# Altium project CAPTIVATE-PGMR.PrjPcb (part 2 of 3)

## Sheet ezfet.SchDoc
size 431 x 279 mm; Date: Not shown in title block; ApprovedBy: Not shown in title block; CheckedBy: Not shown in title block; Author: Not shown in title block; CompanyName: Not shown in title block; Engineer: Not shown in title block; Organization: Not shown in title block; Address1: Not shown in title block; Address2: Not shown in title block; Address3: Not shown in title block; Address4: Not shown in title block; DocumentNumber: 1; Revision: Use project parameter SCH_Rev; SheetNumber: 1; SheetTotal: 6; PageSetup: Record=PageOptions|CenterHorizontal=True|CenterVertical=True|PrintScale=1.00|XCorrection=1.00|YCorrection=1.00|PrintKind=0|BorderSize=5000000|LeftOffset=0|BottomOffset=0|Orientation=2|PaperLength=1000|PaperWidth=1000|Scale=100|PaperSource=15|PrintQuality=600|MediaType=1|DitherType=10|PaperKind=Letter|PrintScaleMode=1; CurrentTime: Not shown in title block; CurrentDate: Not shown in title block; Time: Not shown in title block; DocumentFullPathAndName: Not shown in title block; DocumentName: Not shown in title block; ModifiedDate: Not shown in title block; ImagePath: Not shown in title block
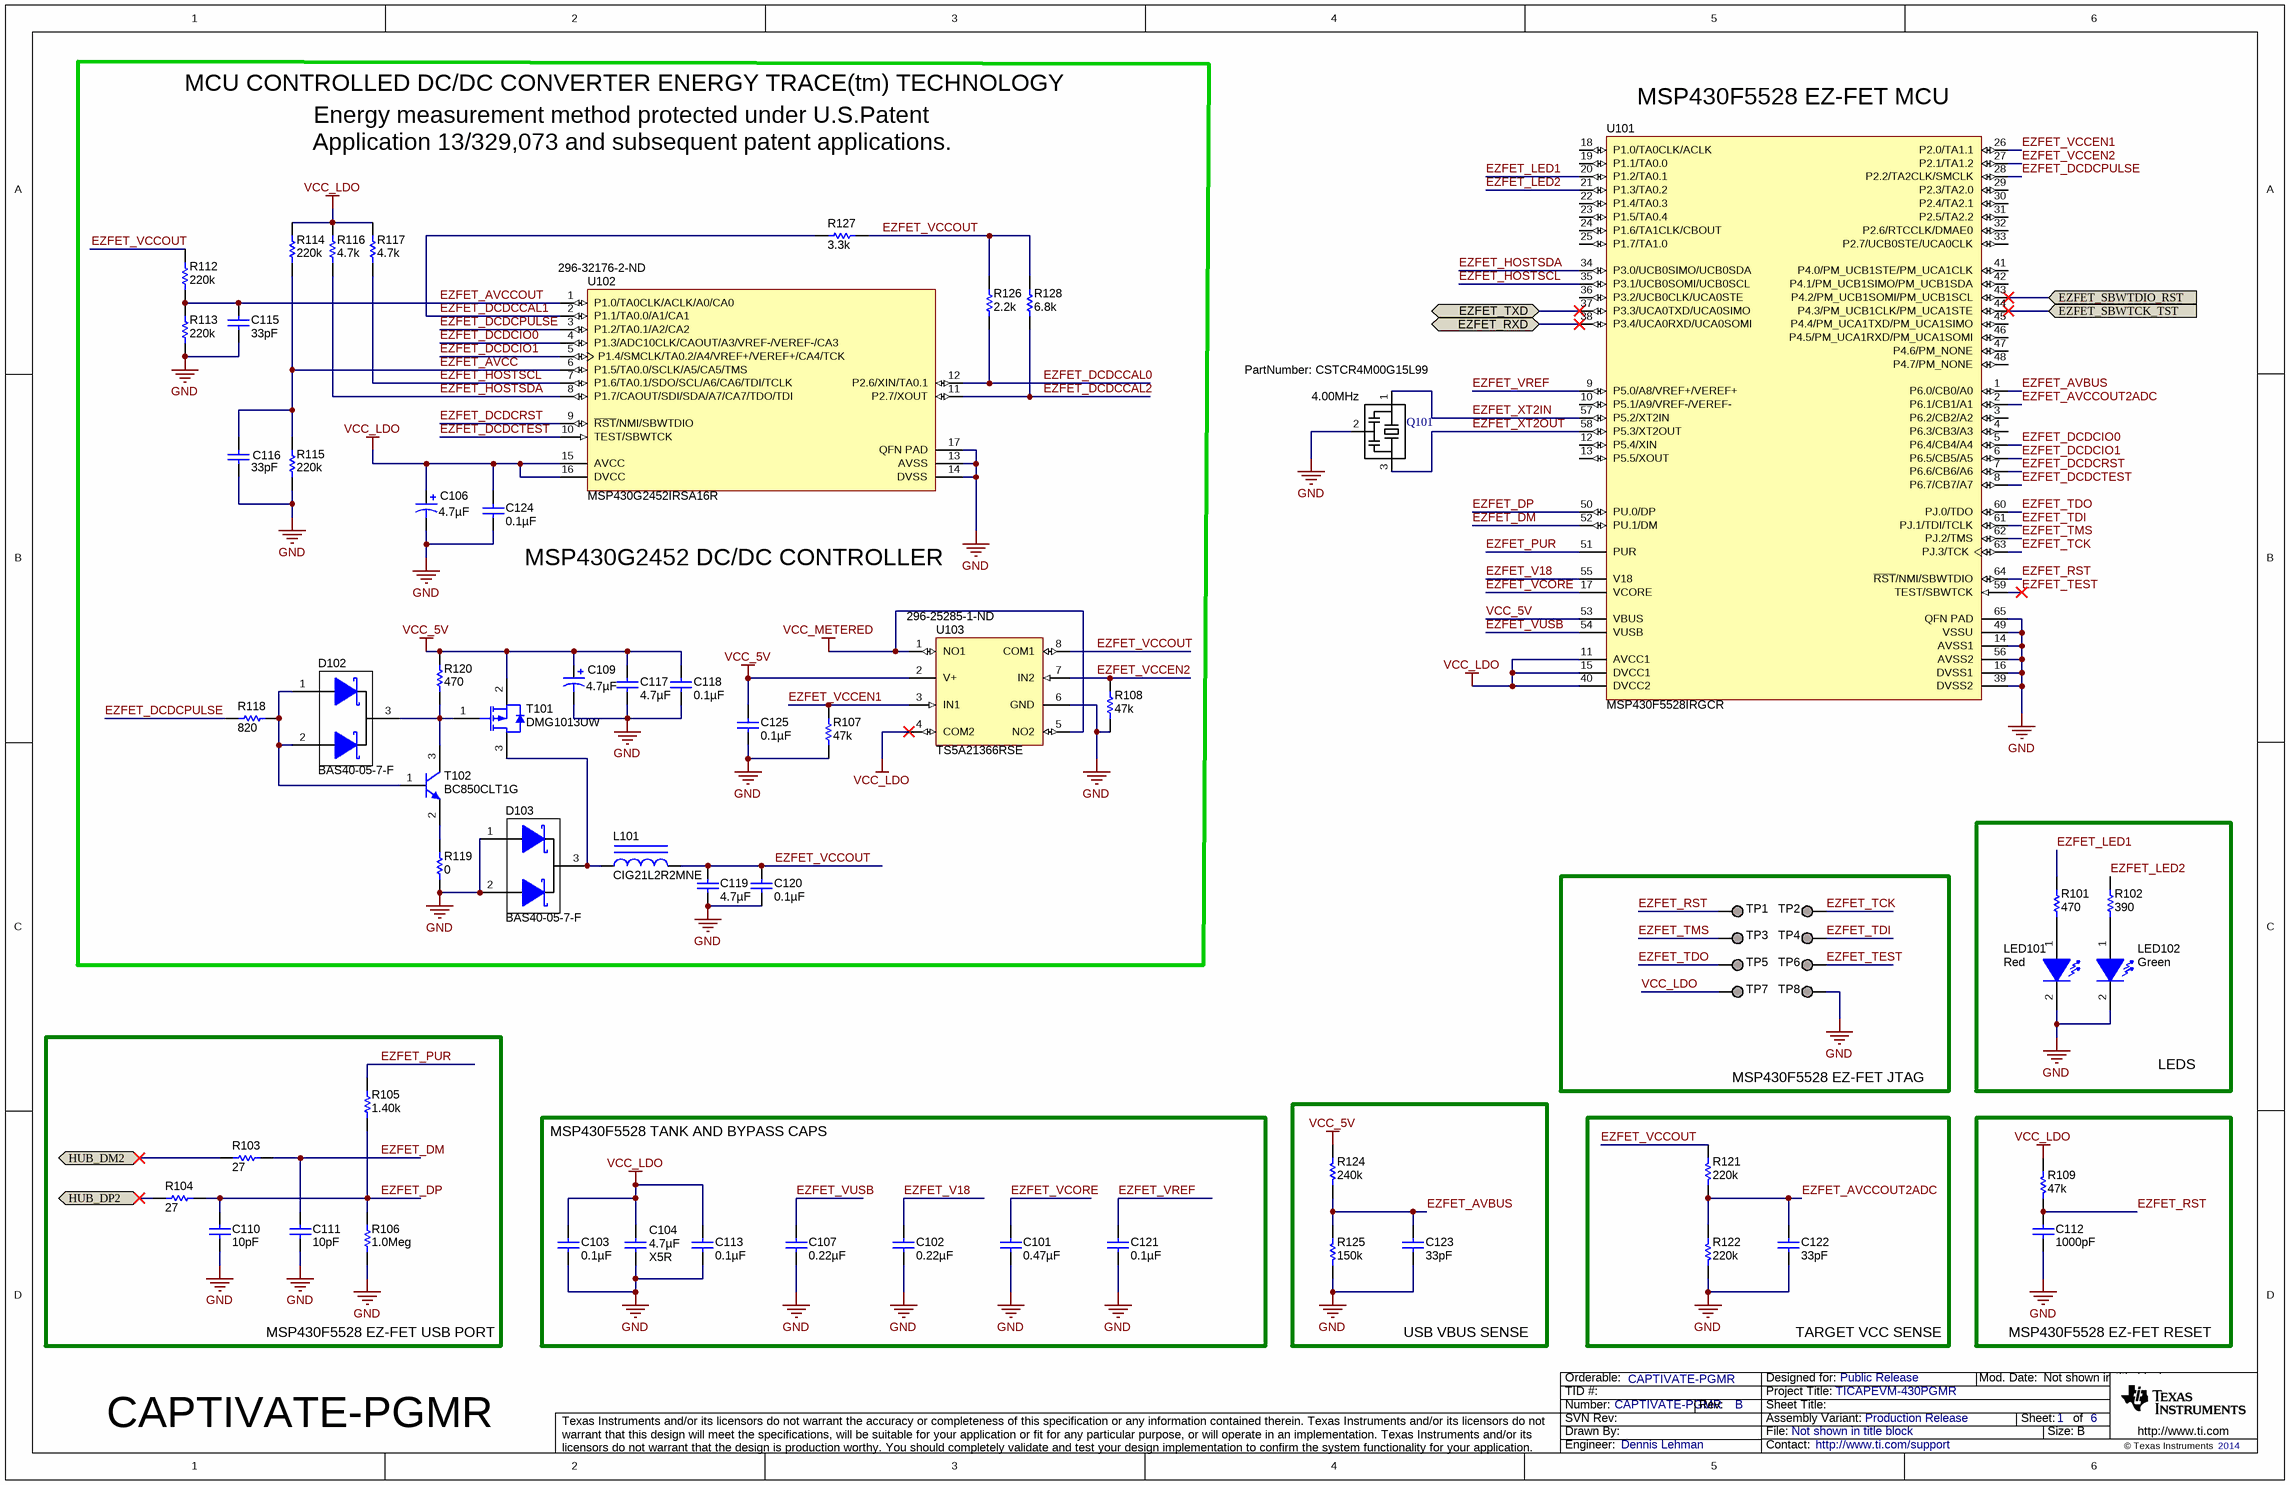
[diagram p2: ezfet.SchDoc]

### Parts
C101  ValueDisplayed: 0.47µF  [0402]  (hidden comment: GRM155R61A474KE15D)
C102  ValueDisplayed: 0.22µF  [0402]  (hidden comment: GRM155R61A224KE19D)
C103  ValueDisplayed: 0.1µF  [0402]  (hidden comment: C1005X5R1A104K)
C104  ValueDisplayed: 4.7µF  TempCo: X5R  [0603]  (hidden comment: CGB3B1X5R1A475K055AC)
C106  ValueDisplayed: 4.7µF  [3216-18]  (hidden comment: 293D475X9010A2TE3)
C107  ValueDisplayed: 0.22µF  [0402]  (hidden comment: GRM155R61A224KE19D)
C109  ValueDisplayed: 4.7µF  [3216-18]  (hidden comment: 293D475X9010A2TE3)
C110  ValueDisplayed: 10pF  [0402]  (hidden comment: 500R07S100JV4T)
C111  ValueDisplayed: 10pF  [0402]  (hidden comment: 500R07S100JV4T)
C112  ValueDisplayed: 1000pF  [0402]  (hidden comment: C1005X7R1H102K)
C113  ValueDisplayed: 0.1µF  [0402]  (hidden comment: C1005X5R1A104K)
C115  ValueDisplayed: 33pF  [0402]  (hidden comment: GRM1555C1H330JA01D)
C116  ValueDisplayed: 33pF  [0402]  (hidden comment: GRM1555C1H330JA01D)
C117  ValueDisplayed: 4.7µF  [0603]  (hidden comment: 0603ZD475KAT2A)
C118  ValueDisplayed: 0.1µF  [0402]  (hidden comment: C1005X5R1A104K)
C119  ValueDisplayed: 4.7µF  [0603]  (hidden comment: 0603ZD475KAT2A)
C120  ValueDisplayed: 0.1µF  [0402]  (hidden comment: C1005X5R1A104K)
C121  ValueDisplayed: 0.1µF  [0402]  (hidden comment: C1005X5R1A104K)
C122  ValueDisplayed: 33pF  [0402]  (hidden comment: GRM1555C1H330JA01D)
C123  ValueDisplayed: 33pF  [0402]  (hidden comment: GRM1555C1H330JA01D)
C124  ValueDisplayed: 0.1µF  [0402]  (hidden comment: C1005X5R1A104K)
C125  ValueDisplayed: 0.1µF  [0402]  (hidden comment: C1005X5R1A104K)
D102  BAS40-05-7-F  [SOT-23]
D103  BAS40-05-7-F  [SOT-23]
L101  CIG21L2R2MNE  [0805_HV]
LED101  value Red  [LED_LTST-C190_Red]  (hidden comment: LTST-C190CKT)
LED102  value Green  [LED_LTST-C190]  (hidden comment: LTST-C190GKT)
Q101  Value Displayed: 4.00MHz  PartNumber: CSTCR4M00G15L99  [CSTCR CERAMIC RESONATOR - MURATA]  (hidden comment: MURATA-FILTER_CSTCR4M00G15)
R101  value 470  [0402]  (hidden comment: CRCW0402470RJNED)
R102  value 390  [0402]  (hidden comment: CRCW0402390RJNED)
R103  value 27  [0402]  (hidden comment: CRCW040227R0JNED)
R104  value 27  [0402]  (hidden comment: CRCW040227R0JNED)
R105  ValueDisplayed: 1.40k  [0402]  (hidden comment: CRCW04021K40FKED)
R106  value 1.0Meg  [0402]  (hidden comment: CRCW04021M00JNED)
R107  ValueDisplayed: 47k  [0402]  (hidden comment: CRCW040247K0JNED)
R108  ValueDisplayed: 47k  [0402]  (hidden comment: CRCW040247K0JNED)
R109  value 47k  [0402]  (hidden comment: CRCW040247K0JNED)
R112  ValueDisplayed: 220k  [0402]  (hidden comment: CRCW0402220KJNED)
R113  ValueDisplayed: 220k  [0402]  (hidden comment: CRCW0402220KJNED)
R114  ValueDisplayed: 220k  [0402]  (hidden comment: CRCW0402220KJNED)
R115  ValueDisplayed: 220k  [0402]  (hidden comment: CRCW0402220KJNED)
R116  ValueDisplayed: 4.7k  [0402]  (hidden comment: CRCW04024K70JNED)
R117  ValueDisplayed: 4.7k  [0402]  (hidden comment: CRCW04024K70JNED)
R118  ValueDisplayed: 820  [0402]  (hidden comment: CRCW0402820RJNED)
R119  ValueDisplayed: 0  [0402]  (hidden comment: CRCW04020000Z0ED)
R120  ValueDisplayed: 470  [0402]  (hidden comment: CRCW0402470RJNED)
R121  value 220k  [0402]  (hidden comment: CRCW0402220KJNED)
R122  value 220k  [0402]  (hidden comment: CRCW0402220KJNED)
R124  value 240k  [0402]  (hidden comment: CRCW0402240KJNED)
R125  value 150k  [0402]  (hidden comment: CRCW0402150KFKED)
R126  ValueDisplayed: 2.2k  [0402]  (hidden comment: CRCW04022K20JNED)
R127  ValueDisplayed: 3.3k  [0402]  (hidden comment: CRCW04023K30JNED)
R128  ValueDisplayed: 6.8k  [0402]  (hidden comment: CRCW04026K80JNED)
T101  DMG1013UW  [SOT-323]
T102  BC850CLT1G  [SOT-23]
TP1  TESTPOINT  [TP_VIA_060RND040]  (value not drawn)  (no BOM)
TP2  TESTPOINT  [TP_VIA_060RND040]  (value not drawn)  (no BOM)
TP3  TESTPOINT  [TP_VIA_060RND040]  (value not drawn)  (no BOM)
TP4  TESTPOINT  [TP_VIA_060RND040]  (value not drawn)  (no BOM)
TP5  TESTPOINT  [TP_VIA_060RND040]  (value not drawn)  (no BOM)
TP6  TESTPOINT  [TP_VIA_060RND040]  (value not drawn)  (no BOM)
TP7  TESTPOINT  [TP_VIA_060RND040]  (value not drawn)  (no BOM)
TP8  TESTPOINT  [TP_VIA_060RND040]  (value not drawn)  (no BOM)
U101  MSP430F5528IRGCR  [RGC0064B]
U102  MSP430G2452IRSA16R  Supplier Part Number 1: 296-32176-2-ND  [RSA0016B]
U103  TS5A21366RSE  Supplier Part Number 1: 296-25285-1-ND  [RSE0008A]

### Blocks framed on the sheet
LEDS: LED101 LED102 R101 R102
MSP430F5528 EZ-FET JTAG: TP1-TP8
MSP430F5528 EZ-FET USB PORT: C110 C111 R103-R106
MSP430F5528 TANK AND BYPASS CAPS: C101-C104 C107 C113 C121
USB VBUS SENSE: C123 R124 R125
TARGET VCC SENSE: C122 R121 R122
MSP430F5528 EZ-FET RESET: C112 R109

### Ports
EZFET_RXD (bidir), EZFET_SBWTCK_TST, EZFET_SBWTDIO_RST, EZFET_TXD (bidir), HUB_DM2 (bidir), HUB_DP2 (bidir)

### Nets
GND: C101.2 C102.2 C103.2 C104.2 C106.2(-) C107.2 C109.2(-) C110.2 C111.2 C112.2 C113.2 C115.2 C116.2 C117.2 C118.2 C119.2 C120.2 C121.2 C122.2 C123.2 C124.2 C125.2 D103.1(A) D103.2(K) LED101.2(K) LED102.2(K) Q101.2 R106.2 R107.1 R108.1 R113.1 R115.1 R119.2 R122.1 R125.1 TP8.1 U101.14(AVSS1) U101.16(DVSS1) U101.39(DVSS2) U101.49(VSSU) U101.56(AVSS2) U101.65(QFN_PAD) U102.13(AVSS) U102.14(DVSS) U102.17(QFN_PAD) U103.6(GND)
VCC_5V: C109.1(+) C117.1 C118.1 C125.1 R120.1 R124.2 T101.2(S) U101.53(VBUS) U103.2(V+)
VCC_LDO: C103.1 C104.1 C106.1(+) C113.1 C124.1 R109.2 R114.2 R116.2 R117.2 TP7.1 U101.11(AVCC1) U101.15(DVCC1) U101.40(DVCC2) U102.15(AVCC) U102.16(DVCC) U103.4(COM2)
VCC_METERED: U103.1(NO1) U103.5(NO2)
EZFET_AVBUS: C123.1 R124.1 R125.2 U101.1(P6.0/CB0/A0)
EZFET_AVCC: C116.1 R114.1 R115.2 U102.6(P1.5/TA0.0/SCLK/A5/CA5/TMS)
EZFET_AVCCOUT: C115.1 R112.1 R113.2 U102.1(P1.0/TA0CLK/ACLK/A0/CA0)
EZFET_AVCCOUT2ADC: C122.1 R121.1 R122.2 U101.2(P6.1/CB1/A1)
EZFET_DCDCCAL0: R126.1 U102.12(P2.6/XIN/TA0.1)
EZFET_DCDCCAL1: R127.1 U102.2(P1.1/TA0.0/A1/CA1)
EZFET_DCDCCAL2: R128.1 U102.11(P2.7/XOUT)
EZFET_DCDCIO0: U101.5(P6.4/CB4/A4) U102.4(P1.3/ADC10CLK/CAOUT/A3/VREF-/VEREF-/CA3)
EZFET_DCDCIO1: U101.6(P6.5/CB5/A5) U102.5(P1.4/SMCLK/TA0.2/A4/VREF+/VEREF+/CA4/TCK)
EZFET_DCDCPULSE: R118.2 U101.28(P2.2/TA2CLK/SMCLK) U102.3(P1.2/TA0.1/A2/CA2)
EZFET_DCDCRST: U101.7(P6.6/CB6/A6) U102.9(~{RST}/NMI/SBWTDIO)
EZFET_DCDCTEST: U101.8(P6.7/CB7/A7) U102.10(TEST/SBWTCK)
EZFET_DM: C111.1 R103.2 U101.52(PU.1/DM)
EZFET_DP: C110.1 R104.2 R105.2 R106.1 U101.50(PU.0/DP)
EZFET_HOSTSCL: R117.1 U101.35(P3.1/UCB0SOMI/UCB0SCL) U102.7(P1.6/TA0.1/SDO/SCL/A6/CA6/TDI/TCLK)
EZFET_HOSTSDA: R116.1 U101.34(P3.0/UCB0SIMO/UCB0SDA) U102.8(P1.7/CAOUT/SDI/SDA/A7/CA7/TDO/TDI)
EZFET_LED1: R101.2 U101.20(P1.2/TA0.1)
EZFET_LED2: R102.2 U101.21(P1.3/TA0.2)
EZFET_PUR: R105.1 U101.51(PUR)
EZFET_RST: C112.1 R109.1 TP1.1 U101.64(~{RST}/NMI/SBWTDIO)
EZFET_RXD: U101.38(P3.4/UCA0RXD/UCA0SOMI) ; port EZFET_RXD
EZFET_SBWTCK_TST: U101.44(P4.3/PM_UCB1CLK/PM_UCA1STE) ; port EZFET_SBWTCK_TST
EZFET_SBWTDIO_RST: U101.43(P4.2/PM_UCB1SOMI/PM_UCB1SCL) ; port EZFET_SBWTDIO_RST
EZFET_TCK: TP2.1 U101.63(PJ.3/TCK)
EZFET_TDI: TP4.1 U101.61(PJ.1/TDI/TCLK)
EZFET_TDO: TP5.1 U101.60(PJ.0/TDO)
EZFET_TEST: TP6.1 U101.59(TEST/SBWTCK)
EZFET_TMS: TP3.1 U101.62(PJ.2/TMS)
EZFET_TXD: U101.37(P3.3/UCA0TXD/UCA0SIMO) ; port EZFET_TXD
EZFET_V18: C102.1 U101.55(V18)
EZFET_VCCEN1: R107.2 U101.26(P2.0/TA1.1) U103.3(IN1)
EZFET_VCCEN2: R108.2 U101.27(P2.1/TA1.2) U103.7(IN2)
EZFET_VCCOUT: C119.1 C120.1 L101.2 R112.2 R121.2 R126.2 R127.2 R128.2 U103.8(COM1)
EZFET_VCORE: C101.1 U101.17(VCORE)
EZFET_VREF: C121.1 U101.9(P5.0/A8/VREF+/VEREF+)
EZFET_VUSB: C107.1 U101.54(VUSB)
EZFET_XT2IN: Q101.1 U101.57(P5.2/XT2IN)
EZFET_XT2OUT: Q101.3 U101.58(P5.3/XT2OUT)
HUB_DM2: R103.1 ; port HUB_DM2
HUB_DP2: R104.1 ; port HUB_DP2
NetD102_1: D102.1(A) D102.2(K) R118.1 T102.1(B)
NetD102_3: D102.3(A) R120.2 T101.1(G) T102.3(C)
NetD103_3: D103.3(A) L101.1 T101.3(D)
NetLED101_1: LED101.1(A) R101.1
NetLED102_1: LED102.1(A) R102.1
NetR119_1: R119.1 T102.2(E)

Not connected (* = marked no-connect by the designer): U101 3(P6.2/CB2/A2) 4(P6.3/CB3/A3) 10(P5.1/A9/VREF-/VEREF-) 12(P5.4/XIN) 13(P5.5/XOUT) 18(P1.0/TA0CLK/ACLK) 19(P1.1/TA0.0) 22(P1.4/TA0.3) 23(P1.5/TA0.4) 24(P1.6/TA1CLK/CBOUT) 25(P1.7/TA1.0) 29(P2.3/TA2.0) 30(P2.4/TA2.1) 31(P2.5/TA2.2) 32(P2.6/RTCCLK/DMAE0) 33(P2.7/UCB0STE/UCA0CLK) 36(P3.2/UCB0CLK/UCA0STE) 41(P4.0/PM_UCB1STE/PM_UCA1CLK) 42(P4.1/PM_UCB1SIMO/PM_UCB1SDA) 45(P4.4/PM_UCA1TXD/PM_UCA1SIMO) 46(P4.5/PM_UCA1RXD/PM_UCA1SOMI) 47(P4.6/PM_NONE) 48(P4.7/PM_NONE)

### Notes on the sheet
- MCU CONTROLLED DC/DC CONVERTER ENERGY TRACE(tm) TECHNOLOGY
- (near U101) MSP430F5528 EZ-FET MCU
- Energy measurement method protected under U.S.Patent
- Application 13/329,073 and subsequent patent applications.
- MSP430G2452 DC/DC CONTROLLER
- CAPTIVATE-PGMR
- Drawn By:
- SVN Rev:
- Number:
- TID #:
- Orderable:
- Rev:
- Sheet Title:
- File:
- Project Title:
- Designed for:
- Assembly Variant:
- Mod. Date:
- Sheet:
- Size:
- of
- B
- http://www.ti.com
- Texas Instruments and/or its licensors do not warrant the accuracy or completeness of this specification or any information contained therein. Texas Instruments and/or its licensors do not warrant that this design will meet the specifications, will be suitable for your application or fit for any particular purpose, or will operate in an implementation. Texas Instruments and/or its licensors do not warrant that the design is production worthy. You should completely validate and test your design implementation to confirm the system functionality for your application.
- Engineer:
- Contact:
- © Texas Instruments

### Library data of the parts
C101 = GRM155R61A474KE15D: CAP, CERM, 0.47uF, 10V, +/-10%, X5R, 0402; Manufacturer: MuRata; Polarized: N; CompType: Capacitor; U/M: EA; Cap_F: 0.00000047; Tolerance_%: 10; Value1: Unknown; TaMin_C: -55; TaMax_C: 85; SymbolVersion: 2008-07-09; Value: 0.47uF; PartNumber: GRM155R61A474KE15D; PackageReference: 0402; RoHS: Y; VDC_V: 10; Value2: 10V; MountType: SMT; Technology: Ceramic; TempCo: X5R; Cap_Case: 0402; Published: 2008-06-19; Publisher: Texas Instruments; LatestRevisionDate: 2013-09-06; ComponentLink1Description: Datasheet link; ComponentLink1URL: http://search.murata.co.jp/Ceramy/PnsearchViewAction.do?HnOFG=ON&HnNFG=ON&SEL_CNT=50&sLang=en&sKey=GRM155R61A474KE15D&x=9&y=9&search=startwith; Supplier 1: Digi-Key; Supplier Part Number 1: 490-3264-1-ND; Supplier 2: Mouser; Supplier Part Number 2: 81-GRM155R61A474KE5D; Supplier 3: Farnell; Supplier Part Number 3: 1828863
C102 C107 = GRM155R61A224KE19D: CAP, CERM, 0.22uF, 10V, +/-10%, X5R, 0402; Manufacturer: MuRata; Polarized: N; CompType: Capacitor; U/M: EA; Cap_F: 0.00000022; Tolerance_%: 10; Value1: Unknown; TaMin_C: -55; TaMax_C: 85; SymbolVersion: 2008-07-09; Value: 0.22uF; PartNumber: GRM155R61A224KE19D; PackageReference: 0402; RoHS: Y; VDC_V: 10; Value2: 10V; MountType: SMT; Technology: Ceramic; TempCo: X5R; Cap_Case: 0402; Published: 2008-06-19; Publisher: Texas Instruments; LatestRevisionDate: 2013-09-06; ComponentLink1Description: Datasheet link; ComponentLink1URL: http://search.murata.co.jp/Ceramy/PnsearchViewAction.do?HnOFG=ON&HnNFG=ON&SEL_CNT=50&sLang=en&sKey=GRM155R61A224KE19D&x=9&y=9&search=startwith; Supplier 1: Digi-Key; Supplier Part Number 1: 490-3910-1-ND; Supplier 2: Mouser; Supplier Part Number 2: 81-GRM155R61A224KE19; Supplier 3: Farnell; Supplier Part Number 3: 8819718
C103 C113 C118 C120 C121 C125 = C1005X5R1A104K: CAP, CERM, 0.1uF, 10V, +/-10%, X5R, 0402; Manufacturer: TDK; Polarized: N; CompType: Capacitor; U/M: EA; Cap_F: 0.0000001; Tolerance_%: 10; ESR_Ohm: 0.0186; Value1: 0.0186 ohm; TaMin_C: -55; TaMax_C: 85; SymbolVersion: 2008-07-09; Value: 0.1uF; PartNumber: C1005X5R1A104K; PackageReference: 0402; RoHS: Y; VDC_V: 10; Value2: 10V; MountType: SMT; Technology: Ceramic; TempCo: X5R; Cap_Case: 0402; Published: 2008-06-19; Publisher: Texas Instruments; LatestRevisionDate: 2013-09-06; ComponentLink1Description: Datasheet link; ComponentLink1URL: http://www.tdk.co.jp/tefe02/e412_c.pdf; Supplier 1: Digi-Key; Supplier Part Number 1: 445-1265-1-ND; Supplier 2: Farnell; Supplier Part Number 2: 1844111
C104 = CGB3B1X5R1A475K055AC: CAP, CERM, 4.7 µF, 10 V, +/- 10%, X5R, 0603; Manufacturer: TDK; Polarized: N; CompType: Capacitor; Value: 4.7uF; U/M: EA; Cap_F: 0.0000047; Tolerance_%: 10; Value1: Unknown; VDC_V: 10V; TaMin_C: -55; TaMax_C: 85; SymbolVersion: 2008-07-09; PartNumber: CGB3B1X5R1A475K055AC; PackageReference: 0603; RoHS: Y; Value2: 10V; MountType: SMT; Technology: Ceramic; Cap_Case: 0603; Publisher: Texas Instruments; LatestRevisionDate: 2014-12-04; ComponentLink1Description: Datasheet link; ComponentLink1URL: http://www.tdk.com/pdf/mlcc_product_guide_A12.pdf; Supplier 1: Digi-Key; Supplier Part Number 1: 445-7482-1-ND; Published: 2008-06-19
C106 C109 = 293D475X9010A2TE3: CAP, TA, 4.7 µF, 10 V, +/- 10%, 5 ohm, SMD; Manufacturer: Vishay-Sprague; Polarized: Y; CompType: Capacitor; Value: 4.7uF; U/M: EA; Cap_F: 0.0000047; Tolerance_%: 10; Value1: 5 ohm; Value2: 10V; ESR_ohm: 5; IRMS_A: 0.12; TaMin_C: -55; TaMax_C: 125; Cap_Case: A; SymbolVersion: 2008-07-09; PartNumber: 293D475X9010A2TE3; PackageReference: 3216-18; RoHS: Y; VDC_V: 10; MountType: SMT; Technology: TA; Series: 293D; Publisher: Texas Instruments; LatestRevisionDate: 2014-11-20; LatestRevisionNote: Updated supplier links; ComponentLink1Description: Datasheet link; ComponentLink1URL: http://www.vishay.com/docs/40002/293d.pdf; Supplier 1: Digi-Key; Supplier Part Number 1: 718-1146-1-ND; Supplier 2: Mouser; Supplier Part Number 2: 74-293D475X9010A2TE3; Supplier 3: Farnell; Supplier Part Number 3: 197397
C110 C111 = 500R07S100JV4T: CAP, CERM, 10pF, 50V, +/-5%, C0G/NP0, 0402; Manufacturer: Johanson Technology; Polarized: N; CompType: Capacitor; U/M: EA; Cap_F: 0.00000000001; Tolerance_%: 5; Value1: Unknown; VDC_V: 50; TaMin_C: -55; TaMax_C: 125; SymbolVersion: 2008-07-09; Value: 10pF; PartNumber: 500R07S100JV4T; PackageReference: 0402; RoHS: Y; Value2: 50V; MountType: SMT; Technology: Ceramic; TempCo: C0G/NP0; Cap_Case: 0402; Published: 2008-06-19; Publisher: Texas Instruments; LatestRevisionDate: 2013-09-06; ComponentLink1Description: Datasheet link; ComponentLink1URL: http://johansontechnology.com/images/stories/rfcaps/mlhqcaps/JTI_MLCC_HighQ_2011_14.pdf; Supplier 1: Digi-Key; Supplier Part Number 1: 712-1253-1-ND; Supplier 2: Farnell; Supplier Part Number 2: 1885333; Supplier 3: Newark; Supplier Part Number 3: 97M6183
C112 = C1005X7R1H102K: CAP, CERM, 1000pF, 50V, +/-10%, X7R, 0402; Manufacturer: TDK; Polarized: N; CompType: Capacitor; U/M: EA; Cap_F: 0.000000001; Tolerance_%: 10; ESR_Ohm: 0.2381; Value1: 0.2381 ohm; VDC_V: 50; TaMin_C: -55; TaMax_C: 125; SymbolVersion: 2008-07-09; Value: 1000pF; PartNumber: C1005X7R1H102K; PackageReference: 0402; RoHS: Y; Value2: 50V; MountType: SMT; Technology: Ceramic; TempCo: X7R; Cap_Case: 0402; Published: 2008-06-19; Publisher: Texas Instruments; LatestRevisionDate: 2013-09-06; ComponentLink1Description: Datasheet link; ComponentLink1URL: http://www.tdk.co.jp/tefe02/e412_c.pdf; Supplier 1: Digi-Key; Supplier Part Number 1: 445-1256-1-ND; Supplier 2: Farnell; Supplier Part Number 2: 1907278
C115 C116 C122 C123 = GRM1555C1H330JA01D: CAP, CERM, 33pF, 50V, +/-5%, C0G/NP0, 0402; Manufacturer: MuRata; Polarized: N; CompType: Capacitor; U/M: EA; Cap_F: 0.000000000033; Tolerance_%: 5; Value1: Unknown; VDC_V: 50; TaMin_C: -55; TaMax_C: 125; SymbolVersion: 2008-07-09; Value: 33pF; PartNumber: GRM1555C1H330JA01D; PackageReference: 0402; RoHS: Y; Value2: 50V; MountType: SMT; Technology: Ceramic; TempCo: C0G/NP0; Cap_Case: 0402; Published: 2008-06-19; Publisher: Texas Instruments; LatestRevisionDate: 2013-09-06; ComponentLink1Description: Datasheet link; ComponentLink1URL: http://search.murata.co.jp/Ceramy/PnsearchViewAction.do?HnOFG=ON&HnNFG=ON&SEL_CNT=50&sLang=en&sKey=GRM1555C1H330JA01D&x=9&y=9&search=startwith; Supplier 1: Mouser; Supplier Part Number 1: 81-GRM1555C1H330JA1D
C117 C119 = 0603ZD475KAT2A: CAP, CERM, 4.7 µF, 10 V, +/- 10%, X5R, 0603; Manufacturer: AVX; Polarized: N; CompType: Capacitor; Value: 4.7uF; U/M: EA; Cap_F: 0.0000047; Tolerance_%: 10; Value1: Unknown; Value2: 10V; TaMin_C: -55; TaMax_C: 85; SymbolVersion: 2008-07-09; PartNumber: 0603ZD475KAT2A; PackageReference: 0603; RoHS: Y; VDC_V: 10; MountType: SMT; Technology: Ceramic; TempCo: X5R; Cap_Case: 0603; Published: 2008-06-19; Publisher: Texas Instruments; LatestRevisionDate: 2014-12-10; ComponentLink1Description: Datasheet link; ComponentLink1URL: http://www.avx.com/docs/Catalogs/cx5r.pdf; Supplier 1: Digi-Key; Supplier Part Number 1: 478-7943-1-ND; Supplier 2: Mouser; Supplier Part Number 2: 581-0603ZD475KAT2A; Supplier 3: Farnell; Supplier Part Number 3: 1833806
C124 = C1005X5R1A104K: CAP, CERM, 0.1 µF, 10 V, +/- 10%, X5R, 0402; Manufacturer: TDK; Polarized: N; CompType: Capacitor; Value: 0.1uF; U/M: EA; Cap_F: 0.0000001; Tolerance_%: 10; ESR_ohm: 0.0186; Value1: 0.0186 ohm; Value2: 10V; TaMin_C: -55; TaMax_C: 85; SymbolVersion: 2008-07-09; PartNumber: C1005X5R1A104K; PackageReference: 0402; RoHS: Y; VDC_V: 10; MountType: SMT; Technology: Ceramic; TempCo: X5R; Cap_Case: 0402; Published: 2008-06-19; Publisher: Texas Instruments; LatestRevisionDate: 2014-12-10; ComponentLink1Description: Datasheet link; ComponentLink1URL: http://www.tdk.co.jp/tefe02/e412_c.pdf; Supplier 1: Digi-Key; Supplier Part Number 1: 445-1265-1-ND; Supplier 2: Farnell; Supplier Part Number 2: 1844111
D102 D103 = BAS40-05-7-F: Diode, Schottky, 40V, 0.2A, SOT-23; Manufacturer: Diodes Inc.; SymbolCreator: a0412235; U/M: EA; Vf_V: 0.9; Value2: 0.9V; Io_A: 0.2; Vr_V: 40; SymbolVersion: 2013-03-27; PartNumber: BAS40-05-7-F; PackageReference: SOT-23; CompType: Diode; Value: 40V; Value1: 0.2A; MountType: SMT; Type: Schottky; RoHS: Y; Published: 2008-06-26; Publisher: Texas Instruments; LatestRevisionDate: 2014-05-28; ComponentLink1Description: Datasheet link; ComponentLink1URL: http://www.diodes.com/datasheets/ds11006.pdf; Supplier 1: Digi-Key; Supplier Part Number 1: BAS40-05DICT-ND; Supplier 2: Mouser; Supplier Part Number 2: 621-BAS40-05-F; Supplier 3: Farnell; Supplier Part Number 3: 1843739
L101 = CIG21L2R2MNE: Inductor, Shielded, Composite, 2.2uH, 0.95A, 0.16 ohm, SMD; Manufacturer: Samsung; Ind_H: 2.2E-6; ValueDisplayed: 2.2µH; Imax_A: 0.95; Irms: 0.95A @ 40C rise; DCR_ohm: 0.16; SymbolVersion: 2008-07-23; CompType: Inductor; Value: 2.2uH; PartNumber: CIG21L2R2MNE; Value1: 0.16 ohm; Value2: 0.95A; Technology: Shielded; MountType: SMT; Material: Composite; PackageReference: 0805; Published: 2008-06-26; Publisher: Texas Instruments; LatestRevisionDate: 2014-05-23; ComponentLink1Description: Datasheet link; ComponentLink1URL: http://www.samsungsem.com/servlet/FileDownload?type=spec&file=CIG21L2R2MNE.pdf; RoHS: Y; Supplier 1: Digi-Key; Supplier Part Number 1: 1276-6202-1-ND
LED101 = LTST-C190CKT: LED, Red, SMD; Manufacturer: Lite-On; Vf_V: 2; Value2: 2V; Io_A: 0.02; Tjmax_C: 85; Power_TotalModule: 0.0625; Value1: 0.0625W; U/M: EA; CompType: LED; PartNumber: LTST-C190CKT; SymbolVersion: 2008-12-08; MountType: SMT; RoHS: Y; PackageReference: Red LED, 1.6x0.8x0.8mm; Type: ?; Color: red; Published: 2008-07-11; Publisher: Texas Instruments; ComponentLink1URL: http://optoelectronics.liteon.com/en-us/api/DwonloadFileHandler.ashx?txtSpecNo=DS-22-98-0009&txtPartNo=LTST-C190CKT; ComponentLink1Description: Datasheet link; LatestRevisionDate: 2013-09-07; Supplier 1: Digi-Key; Supplier Part Number 1: 160-1181-1-ND; Supplier 2: Mouser; Supplier Part Number 2: 859-LTST-C190CKT
LED102 = LTST-C190GKT: LED, Green, SMD; Manufacturer: Lite-On; Vf_V: 2.1; Value2: 2.1V; Io_A: 0.02; Power_TotalModule: 0.1; Value1: 0.1W; U/M: EA; CompType: LED; PartNumber: LTST-C190GKT; SymbolVersion: 2008-12-08; MountType: SMT; RoHS: Y; PackageReference: 1.6x0.8x0.8mm; Type: ?; Color: green; Published: 2008-07-11; Publisher: Texas Instruments; ComponentLink1URL: https://sps06.itg.ti.com/sites/KMS/crossdivteams/altium/docs/ComponentDatasheets/LTST-C190GKT.pdf; ComponentLink1Description: Datasheet link; LatestRevisionDate: 2013-09-07; Supplier 1: Digi-Key; Supplier Part Number 1: 160-1183-1-ND; Supplier 2: Mouser; Supplier Part Number 2: 859-LTST-C190GKT
Q101 = MURATA-FILTER_CSTCR4M00G15: 4.00MHz resonator; Supplier 1: Murata; Supplier Part Number 1: CSTCR4M00G15L99
R101 = CRCW0402470RJNED: RES, 470 ohm, 5%, 0.063W, 0402; Manufacturer: Vishay-Dale; CompType: Resistor; Value_Code: 470R; Tolerance_%: 5; Power_W: 0.063; VDC_V: 50; TempCo: 200 ppm/C; EIA_Code: E24; U/M: EA; SymbolVersion: 2009-05-29; PartNumber: CRCW0402470RJNED; PackageReference: 0402; RoHS: Y; Res_ohm: 470; Value1: 5%; Value2: 0.063W; MountType: SMT; Technology: Thick Film; Published: 2008-06-26; Publisher: Texas Instruments; LatestRevisionDate: 2013-01-08; ComponentLink1Description: Datasheet link; ComponentLink1URL: http://www.vishay.com/docs/20035/dcrcwe3.pdf; Supplier 1: Digi-Key; Supplier Part Number 1: 541-470JCT-ND; Supplier 2: Mouser; Supplier Part Number 2: 71-CRCW0402J-470-E3; Supplier 3: Farnell; Supplier Part Number 3: 1537425
R102 = CRCW0402390RJNED: RES, 390 ohm, 5%, 0.063W, 0402; Manufacturer: Vishay-Dale; CompType: Resistor; Value_Code: 390R; Tolerance_%: 5; Power_W: 0.063; VDC_V: 50; TempCo: 200 ppm/C; EIA_Code: E24; U/M: EA; SymbolVersion: 2009-05-29; PartNumber: CRCW0402390RJNED; PackageReference: 0402; RoHS: Y; Res_ohm: 390; Value1: 5%; Value2: 0.063W; MountType: SMT; Technology: Thick Film; Published: 2008-06-26; Publisher: Texas Instruments; LatestRevisionDate: 2013-01-08; ComponentLink1Description: Datasheet link; ComponentLink1URL: http://www.vishay.com/docs/20035/dcrcwe3.pdf; Supplier 1: Digi-Key; Supplier Part Number 1: 541-390JCT-ND; Supplier 2: Mouser; Supplier Part Number 2: 71-CRCW0402J-390-E3; Supplier 3: Farnell; Supplier Part Number 3: 1514701
R103 R104 = CRCW040227R0JNED: RES, 27 ohm, 5%, 0.063W, 0402; Manufacturer: Vishay-Dale; CompType: Resistor; Value_Code: 27R0; Tolerance_%: 5; Power_W: 0.063; VDC_V: 50; TempCo: 200 ppm/C; EIA_Code: E24; U/M: EA; SymbolVersion: 2009-05-29; PartNumber: CRCW040227R0JNED; PackageReference: 0402; RoHS: Y; Res_ohm: 27; Value1: 5%; Value2: 0.063W; MountType: SMT; Technology: Thick Film; Published: 2008-06-26; Publisher: Texas Instruments; LatestRevisionDate: 2013-01-08; ComponentLink1Description: Datasheet link; ComponentLink1URL: http://www.vishay.com/docs/20035/dcrcwe3.pdf; Supplier 1: Digi-Key; Supplier Part Number 1: 541-27JCT-ND; Supplier 2: Mouser; Supplier Part Number 2: 71-CRCW0402J-27-E3; Supplier 3: Farnell; Supplier Part Number 3: 1514690
R105 = CRCW04021K40FKED: RES, 1.40 k, 1%, 0.063 W, 0402; Manufacturer: Vishay-Dale; CompType: Resistor; Res_ohm: 1400; Value_Code: 1k40; Tolerance_%: 1; Power_W: 0.063; Value2: 0.063W; VDC_V: 50; TempCo: 100 ppm/C; EIA_Code: E96; U/M: EA; Value: 1.40k; SymbolVersion: 2009-05-29; PartNumber: CRCW04021K40FKED; PackageReference: 0402; RoHS: Y; Value1: 1%; MountType: SMT; Technology: Thick Film; Published: 2008-06-26; Publisher: Texas Instruments; LatestRevisionDate: 2014-11-19; ComponentLink1Description: Datasheet link; ComponentLink1URL: http://www.vishay.com/docs/20035/dcrcwe3.pdf; Supplier 1: Digi-Key; Supplier Part Number 1: 541-1.40KLCT-ND; Supplier 2: Mouser; Supplier Part Number 2: 71-CRCW0402-1.4K-E3; Supplier 3: Farnell; Supplier Part Number 3: 1469664
R106 = CRCW04021M00JNED: RES, 1.0Meg ohm, 5%, 0.063W, 0402; Manufacturer: Vishay-Dale; CompType: Resistor; Res_ohm: 1000000; Value_Code: 1M00; Tolerance_%: 5; Power_W: 0.063; VDC_V: 50; TempCo: 200 ppm/C; EIA_Code: E24; U/M: EA; SymbolVersion: 2009-05-29; PartNumber: CRCW04021M00JNED; PackageReference: 0402; RoHS: Y; Value1: 5%; Value2: 0.063W; MountType: SMT; Technology: Thick Film; Published: 2008-06-26; Publisher: Texas Instruments; LatestRevisionDate: 2013-01-08; ComponentLink1Description: Datasheet link; ComponentLink1URL: http://www.vishay.com/docs/20035/dcrcwe3.pdf; Supplier 1: Digi-Key; Supplier Part Number 1: 541-1.0MJCT-ND; Supplier 2: Mouser; Supplier Part Number 2: 71-CRCW0402J-1M-E3; Supplier 3: Farnell; Supplier Part Number 3: 1514661
R107 R108 = CRCW040247K0JNED: RES, 47 k, 5%, 0.063 W, 0402; Manufacturer: Vishay-Dale; CompType: Resistor; Res_ohm: 47000; Value_Code: 47k0; Tolerance_%: 5; Power_W: 0.063; Value2: 0.063W; VDC_V: 50; TempCo: 200 ppm/C; EIA_Code: E24; U/M: EA; Value: 47k; SymbolVersion: 2009-05-29; PartNumber: CRCW040247K0JNED; PackageReference: 0402; RoHS: Y; Value1: 5%; MountType: SMT; Technology: Thick Film; Published: 2008-06-26; Publisher: Texas Instruments; LatestRevisionDate: 2014-11-19; ComponentLink1Description: Datasheet link; ComponentLink1URL: http://www.vishay.com/docs/20035/dcrcwe3.pdf; Supplier 1: Digi-Key; Supplier Part Number 1: 541-47KJCT-ND; Supplier 2: Mouser; Supplier Part Number 2: 71-CRCW0402-J-47K-E3; Supplier 3: Farnell; Supplier Part Number 3: 1514553
R109 = CRCW040247K0JNED: RES, 47k ohm, 5%, 0.063W, 0402; Manufacturer: Vishay-Dale; CompType: Resistor; Res_ohm: 47000; Value_Code: 47k0; Tolerance_%: 5; Power_W: 0.063; VDC_V: 50; TempCo: 200 ppm/C; EIA_Code: E24; U/M: EA; SymbolVersion: 2009-05-29; PartNumber: CRCW040247K0JNED; PackageReference: 0402; RoHS: Y; Value1: 5%; Value2: 0.063W; MountType: SMT; Technology: Thick Film; Published: 2008-06-26; Publisher: Texas Instruments; LatestRevisionDate: 2013-01-08; ComponentLink1Description: Datasheet link; ComponentLink1URL: http://www.vishay.com/docs/20035/dcrcwe3.pdf; Supplier 1: Digi-Key; Supplier Part Number 1: 541-47KJCT-ND; Supplier 2: Farnell; Supplier Part Number 2: 1514553; Supplier 3: Newark; Supplier Part Number 3: 52K7099
R112-R115 = CRCW0402220KJNED: RES, 220 k, 5%, 0.063 W, 0402; Manufacturer: Vishay-Dale; CompType: Resistor; Value: 220k; Res_ohm: 220000; Tolerance_%: 5; Power_W: 0.063; Value2: 0.063W; VDC_V: 50; TempCo: 200 ppm/C; EIA_Code: E24; U/M: EA; SymbolVersion: 2009-05-29; PartNumber: CRCW0402220KJNED; PackageReference: 0402; RoHS: Y; Value_Code: 220k; Value1: 5%; MountType: SMT; Technology: Thick Film; Published: 2008-06-26; Publisher: Texas Instruments; LatestRevisionDate: 2014-11-19; ComponentLink1Description: Datasheet link; ComponentLink1URL: http://www.vishay.com/docs/20035/dcrcwe3.pdf; Supplier 1: Digi-Key; Supplier Part Number 1: 541-220KJCT-ND; Supplier 2: Mouser; Supplier Part Number 2: 71-CRCW0402J-220K-E3; Supplier 3: Farnell; Supplier Part Number 3: 1514686
R116 R117 = CRCW04024K70JNED: RES, 4.7 k, 5%, 0.063 W, 0402; Manufacturer: Vishay-Dale; CompType: Resistor; Value: 4.7k; Res_ohm: 4700; Value_Code: 4k70; Tolerance_%: 5; Power_W: 0.063; Value2: 0.063W; VDC_V: 50; TempCo: 200 ppm/C; EIA_Code: E24; U/M: EA; SymbolVersion: 2009-05-29; PartNumber: CRCW04024K70JNED; PackageReference: 0402; RoHS: Y; Value1: 5%; MountType: SMT; Technology: Thick Film; Published: 2008-06-26; Publisher: Texas Instruments; LatestRevisionDate: 2014-11-19; ComponentLink1Description: Datasheet link; ComponentLink1URL: http://www.vishay.com/docs/20035/dcrcwe3.pdf; Supplier 1: Digi-Key; Supplier Part Number 1: 541-4.7KJCT-ND; Supplier 2: Mouser; Supplier Part Number 2: 71-CRCW0402J-4.7K-E3; Supplier 3: Farnell; Supplier Part Number 3: 1514704
R118 = CRCW0402820RJNED: RES, 820, 5%, 0.063 W, 0402; Manufacturer: Vishay-Dale; CompType: Resistor; Value_Code: 820R; Tolerance_%: 5; Power_W: 0.063; Value2: 0.063W; VDC_V: 50; TempCo: 200 ppm/C; EIA_Code: E24; U/M: EA; Value: 820; SymbolVersion: 2009-05-29; PartNumber: CRCW0402820RJNED; PackageReference: 0402; RoHS: Y; Res_ohm: 820; Value1: 5%; MountType: SMT; Technology: Thick Film; Published: 2008-06-26; Publisher: Texas Instruments; LatestRevisionDate: 2014-11-19; ComponentLink1Description: Datasheet link; ComponentLink1URL: http://www.vishay.com/docs/20035/dcrcwe3.pdf; Supplier 1: Digi-Key; Supplier Part Number 1: 541-820JCT-ND; Supplier 2: Mouser; Supplier Part Number 2: 71-CRCW0402J-820-E3; Supplier 3: Farnell; Supplier Part Number 3: 1570698
R119 = CRCW04020000Z0ED: RES, 0, 5%, 0.063 W, 0402; Manufacturer: Vishay-Dale; CompType: Resistor; Value_Code: 0000; Tolerance_%: 5; Power_W: 0.063; Value2: 0.063W; VDC_V: 50; TempCo: 200 ppm/C; EIA_Code: E24; U/M: EA; Value: 0; SymbolVersion: 2009-05-29; PartNumber: CRCW04020000Z0ED; PackageReference: 0402; RoHS: Y; Res_ohm: 0; Value1: 5%; MountType: SMT; Technology: Thick Film; Published: 2008-06-26; Publisher: Texas Instruments; LatestRevisionDate: 2014-11-19; ComponentLink1Description: Datasheet link; ComponentLink1URL: http://www.vishay.com/docs/20035/dcrcwe3.pdf; Supplier 1: Digi-Key; Supplier Part Number 1: 541-0.0JCT-ND; Supplier 2: Mouser; Supplier Part Number 2: 71-CRCW0402-0-E3; Supplier 3: Farnell; Supplier Part Number 3: 1469661
R120 = CRCW0402470RJNED: RES, 470, 5%, 0.063 W, 0402; Manufacturer: Vishay-Dale; CompType: Resistor; Value_Code: 470R; Tolerance_%: 5; Power_W: 0.063; Value2: 0.063W; VDC_V: 50; TempCo: 200 ppm/C; EIA_Code: E24; U/M: EA; Value: 470; SymbolVersion: 2009-05-29; PartNumber: CRCW0402470RJNED; PackageReference: 0402; RoHS: Y; Res_ohm: 470; Value1: 5%; MountType: SMT; Technology: Thick Film; Published: 2008-06-26; Publisher: Texas Instruments; LatestRevisionDate: 2014-11-19; ComponentLink1Description: Datasheet link; ComponentLink1URL: http://www.vishay.com/docs/20035/dcrcwe3.pdf; Supplier 1: Digi-Key; Supplier Part Number 1: 541-470JCT-ND; Supplier 2: Mouser; Supplier Part Number 2: 71-CRCW0402J-470-E3; Supplier 3: Farnell; Supplier Part Number 3: 1537425
R121 R122 = CRCW0402220KJNED: RES, 220k ohm, 5%, 0.063W, 0402; Manufacturer: Vishay-Dale; CompType: Resistor; Res_ohm: 220000; Tolerance_%: 5; Power_W: 0.063; VDC_V: 50; TempCo: 200 ppm/C; EIA_Code: E24; U/M: EA; SymbolVersion: 2009-05-29; PartNumber: CRCW0402220KJNED; PackageReference: 0402; RoHS: Y; Value_Code: 220k; Value1: 5%; Value2: 0.063W; MountType: SMT; Technology: Thick Film; Published: 2008-06-26; Publisher: Texas Instruments; LatestRevisionDate: 2013-01-08; ComponentLink1Description: Datasheet link; ComponentLink1URL: http://www.vishay.com/docs/20035/dcrcwe3.pdf; Supplier 1: Digi-Key; Supplier Part Number 1: 541-220KJCT-ND; Supplier 2: Farnell; Supplier Part Number 2: 1514686; Supplier 3: Newark; Supplier Part Number 3: 59M6717
R124 = CRCW0402240KJNED: RES, 240k ohm, 5%, 0.063W, 0402; Manufacturer: Vishay-Dale; CompType: Resistor; Res_ohm: 240000; Tolerance_%: 5; Power_W: 0.063; VDC_V: 50; TempCo: 200 ppm/C; EIA_Code: E24; U/M: EA; SymbolVersion: 2009-05-29; PartNumber: CRCW0402240KJNED; PackageReference: 0402; RoHS: Y; Value_Code: 240k; Value1: 5%; Value2: 0.063W; MountType: SMT; Technology: Thick Film; Published: 2008-06-26; Publisher: Texas Instruments; LatestRevisionDate: 2013-01-08; ComponentLink1Description: Datasheet link; ComponentLink1URL: http://www.vishay.com/docs/20035/dcrcwe3.pdf; Supplier 1: Digi-Key; Supplier Part Number 1: 541-240KJCT-ND
R125 = CRCW0402150KFKED: RES, 150k ohm, 1%, 0.063W, 0402; Manufacturer: Vishay-Dale; CompType: Resistor; Res_ohm: 150000; Tolerance_%: 1; Power_W: 0.063; VDC_V: 50; TempCo: 100 ppm/C; EIA_Code: E96; U/M: EA; SymbolVersion: 2009-05-29; PartNumber: CRCW0402150KFKED; PackageReference: 0402; RoHS: Y; Value_Code: 150k; Value1: 1%; Value2: 0.063W; MountType: SMT; Technology: Thick Film; Published: 2008-06-26; Publisher: Texas Instruments; LatestRevisionDate: 2013-01-08; ComponentLink1Description: Datasheet link; ComponentLink1URL: http://www.vishay.com/docs/20035/dcrcwe3.pdf; Supplier 1: Digi-Key; Supplier Part Number 1: 541-150KLCT-ND; Supplier 2: Mouser; Supplier Part Number 2: 71-CRCW0402-150K-E3; Supplier 3: Farnell; Supplier Part Number 3: 1652753
R126 = CRCW04022K20JNED: RES, 2.2 k, 5%, 0.063 W, 0402; Manufacturer: Vishay-Dale; CompType: Resistor; Value: 2.2k; Res_ohm: 2200; Value_Code: 2k20; Tolerance_%: 5; Power_W: 0.063; Value2: 0.063W; VDC_V: 50; TempCo: 200 ppm/C; EIA_Code: E24; U/M: EA; SymbolVersion: 2009-05-29; PartNumber: CRCW04022K20JNED; PackageReference: 0402; RoHS: Y; Value1: 5%; MountType: SMT; Technology: Thick Film; Published: 2008-06-26; Publisher: Texas Instruments; LatestRevisionDate: 2014-11-19; ComponentLink1Description: Datasheet link; ComponentLink1URL: http://www.vishay.com/docs/20035/dcrcwe3.pdf; Supplier 1: Digi-Key; Supplier Part Number 1: 541-2.2KJCT-ND; Supplier 2: Mouser; Supplier Part Number 2: 71-CRCW0402J-2.2K-E3; Supplier 3: Farnell; Supplier Part Number 3: 1514678
R127 = CRCW04023K30JNED: RES, 3.3 k, 5%, 0.063 W, 0402; Manufacturer: Vishay-Dale; CompType: Resistor; Value: 3.3k; Res_ohm: 3300; Value_Code: 3k30; Tolerance_%: 5; Power_W: 0.063; Value2: 0.063W; VDC_V: 50; TempCo: 200 ppm/C; EIA_Code: E24; U/M: EA; SymbolVersion: 2009-05-29; PartNumber: CRCW04023K30JNED; PackageReference: 0402; RoHS: Y; Value1: 5%; MountType: SMT; Technology: Thick Film; Published: 2008-06-26; Publisher: Texas Instruments; LatestRevisionDate: 2014-11-19; ComponentLink1Description: Datasheet link; ComponentLink1URL: http://www.vishay.com/docs/20035/dcrcwe3.pdf; Supplier 1: Digi-Key; Supplier Part Number 1: 541-3.3KJCT-ND; Supplier 2: Mouser; Supplier Part Number 2: 71-CRCW0402J-3.3K-E3; Supplier 3: Farnell; Supplier Part Number 3: 1514692
R128 = CRCW04026K80JNED: RES, 6.8 k, 5%, 0.063 W, 0402; Manufacturer: Vishay-Dale; CompType: Resistor; Value: 6.8k; Res_ohm: 6800; Value_Code: 6k80; Tolerance_%: 5; Power_W: 0.063; Value2: 0.063W; VDC_V: 50; TempCo: 200 ppm/C; EIA_Code: E24; U/M: EA; SymbolVersion: 2009-05-29; PartNumber: CRCW04026K80JNED; PackageReference: 0402; RoHS: Y; Value1: 5%; MountType: SMT; Technology: Thick Film; Published: 2008-06-26; Publisher: Texas Instruments; LatestRevisionDate: 2014-11-19; ComponentLink1Description: Datasheet link; ComponentLink1URL: http://www.vishay.com/docs/20035/dcrcwe3.pdf; Supplier 1: Digi-Key; Supplier Part Number 1: 541-6.8KJCT-ND; Supplier 2: Mouser; Supplier Part Number 2: 71-CRCW0402J-6.8K-E3; Supplier 3: Farnell; Supplier Part Number 3: 1537431
T101 = BSS84W-7-F: MOSFET, P-CH, -50V, -0.13A, SOT-323; Manufacturer: Diodes Inc.; Alternate Manufacturer: None; U/M: EA; ChType: P; VdsMax_V: -50; Value1: 10 ohm; Rdson45_Ohm: 10; Value2: ? nC; Vgs_V: -20; IdsMax_A: -0.13; SymbolVersion: 2008-07-09; PartNumber: BSS84W-7-F; PackageReference: SOT-323; CompType: MOSFET; Value: -50V; RoHS: Y; MountType: SMT; Published: 2008-06-19; Publisher: Texas Instruments; LatestRevisionDate: 2014-05-29; LatestRevisionNote: Added parts.; ComponentLink1Description: Datasheet link; ComponentLink1URL: http://www.diodes.com/datasheets/ds30205.pdf; Supplier 1: Digi-Key; Supplier Part Number 1: BSS84W-FDICT-ND; Supplier 2: Mouser; Supplier Part Number 2: 621-BSS84W-F; Supplier 3: Farnell; Supplier Part Number 3: 1713836
T102 = BC850CLT1G, ON Semiconductor: Transistor, NPN, 45V, 0.1A, SOT-23; CompType: BJT; PNP: 0; NPN: 1; Vceo_V: 45; Vcesat1_V: 0.7; Value: 0.7V; IcRated_A: 0.1; HfeMax: 800; TaMin_C: -55; TaMax_C: 150; U/M: EA; SymbolVersion: 2008-07-31; PartNumber: BC850CLT1G; Manufacturer: ON Semiconductor; PackageReference: SOT-23; RoHS: Y; Value1: 0.1A; Value2: 800; Published: 2008-07-31; LatestRevisionDate: 2014-05-16; Publisher: Texas Instruments; ComponentLink1Description: Datasheet link; ComponentLink1URL: http://www.onsemi.com/pub_link/Collateral/BC846ALT1-D.PDF; Supplier 1: Digi-Key; Supplier Part Number 1: BC850CLT1GOSCT-ND; Supplier 2: Farnell; Supplier Part Number 2: 1278476; MountType: SMT
TP1-TP8 = TESTPOINT: TEST POINT.  No entry in BOM.; SymbolVersion: 2010-10-20; CompType: Testpoint; PackageReference: N/A; Publisher: Texas Instruments; LatestRevisionDate: 2014-12-30; LatestRevisionNote: Added Alternate PartNumber and Alternate Manufacturer parameters to appropriate components.
U101 = MSP430F5528IRGCR: 25 MHz Mixed Signal Microcontroller with 128 KB Flash, 8192 B SRAM and 47 GPIOs, -40 to 85 degC, 64-pin QFN (RGC), Green (RoHS & no Sb/Br); Manufacturer: Texas Instruments; ADC: 12-bit SAR; ADC Channels: 16; Brown Out Reset: Yes; DMA: 3; Flash(KB): 128; Frequency(MHz): 25; GPIO: 47; Multiplier: 32x32; SRAM(B): 8192; SubFamily: 5 Series; Timers - 16-bit: 4; USB: 1; USCI_A (UART/LIN/IrDA/SPI): 2; DatasheetVersion: SLAS590I; PackageVersion: 4204106/F; PackageReference: RGC0064B; PackageDescription: 64-Pin Plastic Flat Pack, Body 9 x 9 mm, Pitch 0.5 mm; Supplier 1: Digi-Key; Supplier Part Number 1: 296-27305-2-ND; Supplier 2: Digi-Key; Supplier Part Number 2: 296-27305-1-ND; Supplier 3: Digi-Key; Supplier Part Number 3: 296-27305-6-ND; Supplier 4: Newark; Supplier Part Number 4: 74R6473; Supplier 5: Mouser; Supplier Part Number 5: 595-MSP430F5527IPNR; Comparators: Yes; Eco-Plan: Green (RoHS & no Sb/Br); Real-Time Clock: Yes; SVS: Yes; Temp Sensor: Yes; USCI_B (I2C & SPI): 2; Watchdog: Yes; Mounting Technology: Surface Mount; PartNumber: MSP430F5528IRGCR; ComponentLink1Description: Manufacturer URL; ComponentLink1URL: http://www.ti.com/; ComponentLink2Description: Datasheet; ComponentLink2URL: http://www.ti.com/general/docs/lit/getliterature.tsp?genericPartNumber=MSP430F5528&fileType=pdf; ComponentLink3Description: Package Specification; ComponentLink3URL: http://www.ti.com/lit/ds/symlink/ucd3138.pdf
U102 = MSP430G2452IRSA16R: 16 MHz Mixed Signal Microcontroller with 8 KB Flash, 256 B SRAM and 16 GPIOs, 16-pin QFN (RSA), Green (RoHS & no Sb/Br); Alternate Manufacturer: Texas Instruments; Alternate PartNumber: Equivalent; ADC: 10-bit SAR; ADC Channels: 8; Brown Out Reset: Yes; Frequency(MHz): 16; Pin/Package: 14TSSOP, 16QFN, 20PDIP, 20TSSOP; SRAM(B): 256; SubFamily: Value Line; Timers - 16-bit: 1; USI: (I2C/SPI); DatasheetVersion: SLAS722E; PackageVersion: 4205141/D, 06/2011; PackageReference: RSA0016B; PackageDescription: 16-Pin Plastic Flat Pack, Body 4.00 x 4.00 mm, Pitch 0.65 mm; Cap touch I/O: Yes; Comparators: Yes; Eco-Plan: Green (RoHS & no Sb/Br); Flash(KB): 8; GPIO: 16; Temp Sensor: Yes; Watchdog: Yes; MountType: SMT; Code_JEDEC: MO-220; ComponentLink1Description: Manufacturer URL; ComponentLink1URL: http://www.ti.com/; ComponentLink2Description: Datasheet; ComponentLink2URL: http://www.ti.com/general/docs/lit/getliterature.tsp?genericPartNumber=MSP430G2452&fileType=pdf; PartNumber: MSP430G2452IRSA16R; Manufacturer: Texas Instruments; Supplier 1: Digi-Key
U103 = TS5A21366RSE: 0.75-Ω DUAL SPST ANALOG SWITCH WITH 1.8-V COMPATIBLE INPUT LOGIC, RSE0008A; Manufacturer: Texas Instruments; SymbolCreator: a0272918; CompType: IC; U/M: EA; SymbolVersion: 2014-12-09; PartNumber: TS5A21366RSE; PackageReference: RES008A; MountType: SMT; ComponentLink1Description: Datasheet Link; ComponentLink1URL: http://www.ti.com/lit/ds/symlink/ts5a21366.pdf; RoHS: Y; Publisher: Texas Instruments; LatestRevisionDate: 2014-12-08; Alternate Manufacturer: Texas Instruments; Supplier 1: Digi-Key